# EAGLE design seeed2040 dev board 11-13-22 (EAGLE 9.6.2)
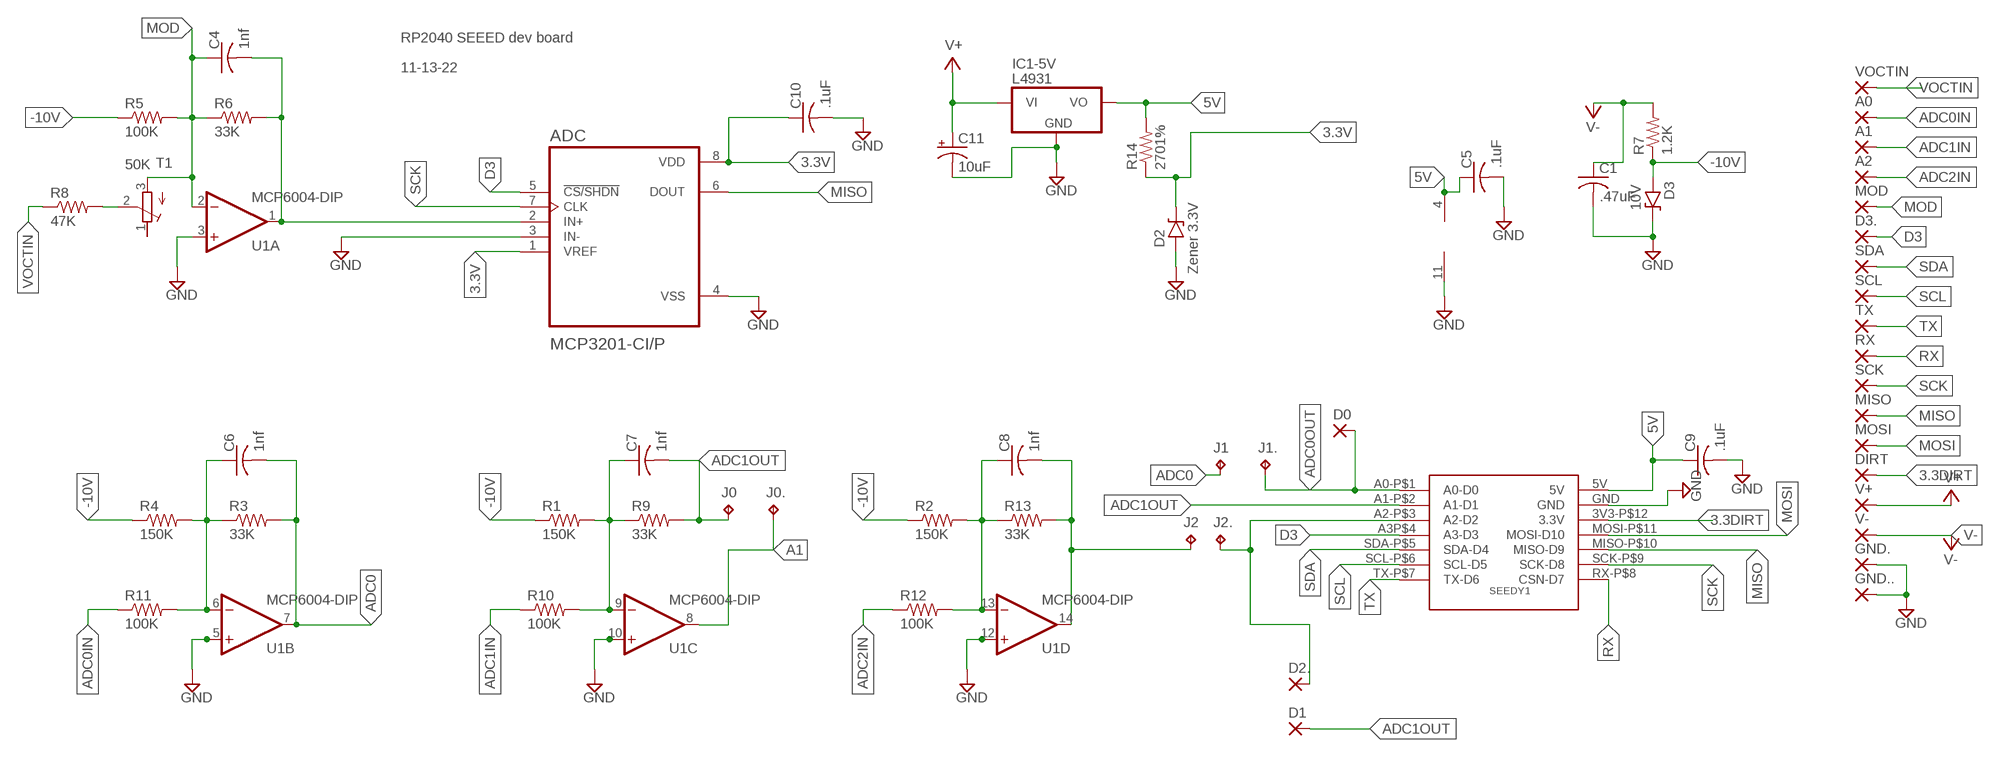
[diagram p0: schematic, sheet 1]

## Parts
A0  WIREPAD1,6/0,9  [1,6/0,9]
A1  WIREPAD1,6/0,9  [1,6/0,9]
A2  WIREPAD1,6/0,9  [1,6/0,9]
ADC  MCP3201-CI/P  [DIP787W46P254L927H533Q8]
C1  .47uF  C-US025-030X050  [C025-030X050]
C4  1nf  C-US025-025X050  [C025-025X050]
C5  .1uF  C-US025-025X050  [C025-025X050]
C6  1nf  C-US025-025X050  [C025-025X050]
C7  1nf  C-US025-025X050  [C025-025X050]
C8  1nf  C-US025-025X050  [C025-025X050]
C9  .1uF  C-US050-025X075  [C050-025X075]
C10  .1uF  C-US025-025X050  [C025-025X050]
C11  10uF  CPOL-USE2.5-7  [E2,5-7]
D0  WIREPAD1,6/0,9  [1,6/0,9]
D1  WIREPAD1,6/0,9  [1,6/0,9]
D2  Zener 3.3V  ZENER.3  [DO41-3]
D2.  WIREPAD1,6/0,9  [1,6/0,9]
D3  10V  ZENER.3  [DO41-3]
D3.  WIREPAD1,6/0,9  [1,6/0,9]
DIRT  WIREPAD1,6/0,9  [1,6/0,9]
GND.  WIREPAD1,6/0,9  [1,6/0,9]
GND..  WIREPAD1,6/0,9  [1,6/0,9]
IC1-5V  L4931  [TO92-]
J0  TPPAD1-13  [P1-13]
J0.  TPPAD1-13  [P1-13]
J1  TPPAD1-13  [P1-13]
J1.  TPPAD1-13  [P1-13]
J2  TPPAD1-13  [P1-13]
J2.  TPPAD1-13  [P1-13]
MISO  WIREPAD1,6/0,9  [1,6/0,9]
MOD  WIREPAD1,6/0,9  [1,6/0,9]
MOSI  WIREPAD1,6/0,9  [1,6/0,9]
R1  150K  R-US_0204/7  [0204/7]
R2  150K  R-US_0204/7  [0204/7]
R3  33K  R-US_0204/7  [0204/7]
R4  150K  R-US_0204/7  [0204/7]
R5  100K  R-US_0204/7  [0204/7]
R6  33K  R-US_0204/7  [0204/7]
R7  1.2K  R-US_0204/7  [0204/7]
R8  47K  R-US_0204/7  [0204/7]
R9  33K  R-US_0204/7  [0204/7]
R10  100K  R-US_0204/7  [0204/7]
R11  100K  R-US_0204/7  [0204/7]
R12  100K  R-US_0204/7  [0204/7]
R13  33K  R-US_0204/7  [0204/7]
R14  2701%  R-US_0204/7  [0204/7]
RX  WIREPAD1,6/0,9  [1,6/0,9]
SCK  WIREPAD1,6/0,9  [1,6/0,9]
SCL  WIREPAD1,6/0,9  [1,6/0,9]
SDA  WIREPAD1,6/0,9  [1,6/0,9]
SEEDY1  SEEED_XIAO_RP2040  [14PIN700MIL]
T1  50K  R-TRIMMT93YA  [RTRIMT93YA]
TX  WIREPAD1,6/0,9  [1,6/0,9]
U1  MCP6004-DIP  [DIL14]
V+  WIREPAD1,6/0,9  [1,6/0,9]
V-  WIREPAD1,6/0,9  [1,6/0,9]
VOCTIN  WIREPAD1,6/0,9  [1,6/0,9]

## Nets
3.3DIRT: DIRT.1(P) SEEDY1.3V3-P$12(3.3V)
3.3V: ADC.1(VREF) ADC.8(VDD) C10.1 D2.C R14.1
5V: C5.1 C9.1 IC1-5V.3(VO) R14.2 SEEDY1.5V U1.4(P:V+)
-10V: D3.A R1.1 R2.1 R4.1 R5.1 R7.1
A1: J0..TP U1.8(C:OUT)
ADC0: C6.2 J1.TP R3.2 U1.7(B:OUT)
ADC0IN: A0.1(P) R11.1
ADC0OUT: D0.1(P) J1..TP SEEDY1.A0-P$1(A0-D0)
ADC1IN: A1.1(P) R10.1
ADC1OUT: C7.2 D1.1(P) J0.TP R9.2 SEEDY1.A1-P$2(A1-D1)
ADC2IN: A2.1(P) R12.1
ADC2OUT: C8.2 J2.TP R13.2 U1.14(D:OUT)
D3: ADC.5(!CS/SHDN) D3..1(P) SEEDY1.A3P$4(A3-D3)
GND: ADC.3(IN-) ADC.4(VSS) C1.2 C5.2 C9.2 C10.2 C11.- D2.A D3.C GND..1(P) GND...1(P) IC1-5V.2(GND) SEEDY1.GND U1.3(A:+IN) U1.5(B:+IN) U1.10(C:+IN) U1.11(P:V-) U1.12(D:+IN)
MISO: ADC.6(DOUT) MISO.1(P) SEEDY1.MISO-P$10(MISO-D9)
MOD: C4.1 MOD.1(P) R5.2 R6.1 T1.3(A) U1.2(A:-IN)
MOSI: MOSI.1(P) SEEDY1.MOSI-P$11(MOSI-D10)
N$1: C6.1 R3.1 R4.2 R11.2 U1.6(B:-IN)
N$3: C7.1 R1.2 R9.1 R10.2 U1.9(C:-IN)
N$4: R8.2 T1.2(S)
N$5: C8.1 R2.2 R12.2 R13.1 U1.13(D:-IN)
N$6: D2..1(P) J2..TP SEEDY1.A2-P$3(A2-D2)
RX: RX.1(P) SEEDY1.RX-P$8(CSN-D7)
SCK: ADC.7(CLK) SCK.1(P) SEEDY1.SCK-P$9(SCK-D8)
SCL: SCL.1(P) SEEDY1.SCL-P$6(SCL-D5)
SDA: SDA.1(P) SEEDY1.SDA-P$5(SDA-D4)
TX: SEEDY1.TX-P$7(TX-D6) TX.1(P)
V+: C11.+ IC1-5V.1(VI) V+.1(P)
V-: C1.1 R7.2 V-.1(P)
VOCTIN: R8.1 VOCTIN.1(P)
VOCTOUT: ADC.2(IN+) C4.2 R6.2 U1.1(A:OUT)
Unconnected: T1.1(E)

## Notes on the sheet
- RP2040 SEEED dev board
- 11-13-22

## Library data of the parts
A0 A1 A2 D0 D1 D2. D3. DIRT GND. GND.. MISO MOD MOSI RX SCK SCL SDA TX V+ V- VOCTIN = wirepad:WIREPAD: Wire PAD connect wire on PCB
ADC = MCP3201-CI_P:MCP3201-CI/P: Check availability <https://pricing.snapeda.com/parts/MCP3201-CI/P/Microchip%20Technology/view-part?ref=eda>; AVAILABILITY: In Stock; DESCRIPTION: 1-Channel Single ADC SAR 100ksps 12-bit Serial Automotive 8-Pin PDIP Tube; MF: Microchip Technology; MP: MCP3201-CI/P; PACKAGE: DIP-8 Microchip; PRICE: None; PURCHASE-URL: https://pricing.snapeda.com/search/part/MCP3201-CI/P/?ref=eda
C1 C4-C8 C10 = rcl:C-US: CAPACITOR, American symbol; SPICEPREFIX: C
C9 = adafruit:C-US: CAPACITOR, American symbol
C11 = rcl:CPOL-US: POLARIZED CAPACITOR, American symbol; SPICEPREFIX: C
D2 D3 = diodes:ZENER
IC1-5V = regulators:L4931
J0 J0. J1 J1. J2 J2. = testpad-CL:TP: Test pad NO NAME
R1-R14 = rcl:R-US_: RESISTOR, American symbol
SEEDY1 = SEEED:SEEED_XIAO_RP2040
T1 = rcl:R-TRIMM: Trimm resistor; SPICEMODEL: X; SPICEPREFIXL: POT
U1 = MusicThingModular-CL:MCP6004-DIP: MCP6004 RAIL TO RAIL QUAD OP AMP

## Board
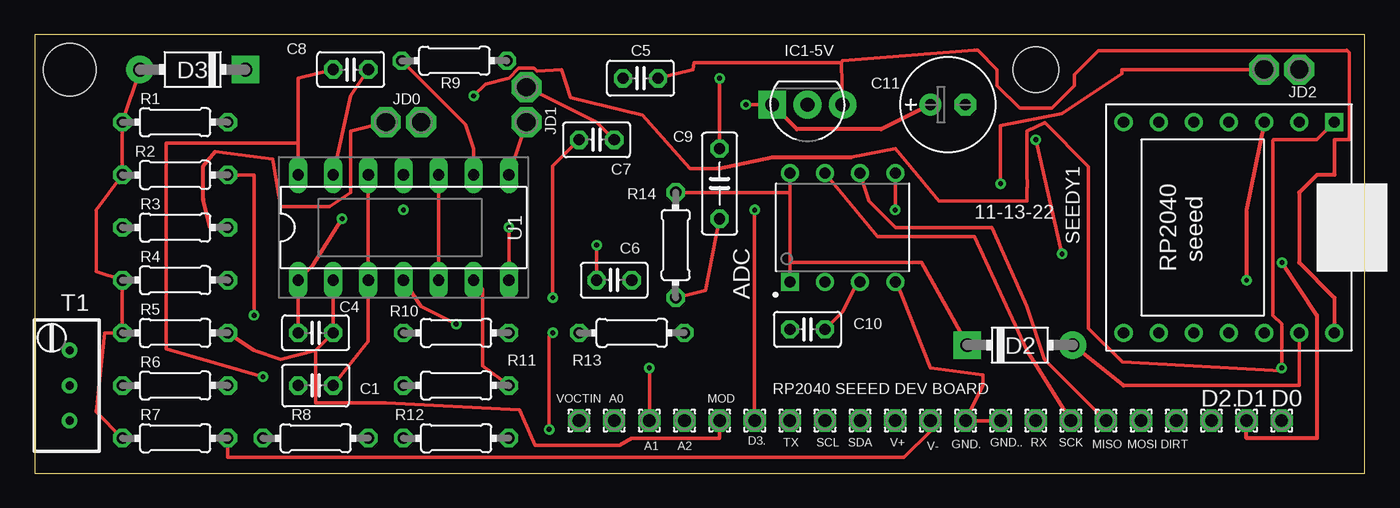
[diagram p1: board, top side]
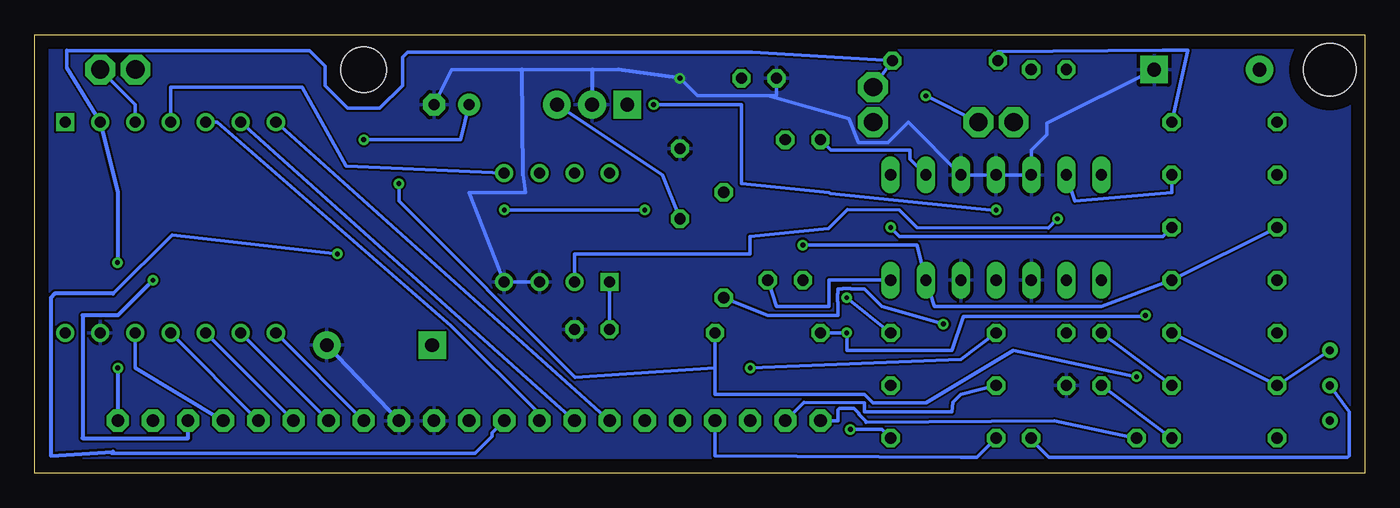
[diagram p2: board, bottom side, seen from below]

Size 96.19 x 31.74 mm. Coordinates in mm from the lower left corner, seen from the top.
Outline: 0,0 96.19,0 96.19,31.74 0,31.74 0,0
Copper layers (1*16): Top 0.035mm / dielectric 1.5mm / Bottom 0.035mm
Design rules "default": minimum track width 6mil, minimum drill 0.35mm, track to track 6mil, track to pad 6mil, pad to pad 6mil, via to via 6mil, smd to smd 6mil, copper to edge 40mil, drill to drill 6mil, minimum pad ring 10mil, minimum via ring 8mil, stop-mask expansion 4mil, vias tented up to drill 0mil, thermal gap 10mil
Holes 3.81 mm at 2.54,29.21
Holes 3.3 mm at 72.39,29.21

### Footprints (pad centres in the part's own frame; a part is rotated, then mirrored left to right if it is on the bottom)
1,6/0,9 = drill 0.914 pad 1.6 octagon: 1 0,0
DIP787W46P254L927H533Q8 = drill 0.8 square: 1 -3.935,3.81 | drill 0.8: 2 -3.935,1.27; 3 -3.935,-1.27; 4 -3.935,-3.81; 5 3.935,-3.81; 6 3.935,-1.27; 7 3.935,1.27; 8 3.935,3.81
C025-030X050 = drill 0.813 octagon: 1 -1.27,0; 2 1.27,0
C025-025X050 = drill 0.813 octagon: 1 -1.27,0; 2 1.27,0
C050-025X075 = drill 0.813 octagon: 1 -2.54,0; 2 2.54,0
E2,5-7 = drill 0.813 pad 1.6: + -1.27,0 | drill 0.813 pad 1.6 octagon: - 1.27,0
DO41-3 = drill 1 pad 2: A 3.81,0 | drill 1 pad 2 square: C -3.81,0
TO92- = drill 1 pad 2 square: 1 -2.54,0 | drill 1 pad 2: 2 0,0; 3 2.54,0
P1-13 = drill 1.321 pad 2.159 octagon: TP 0,0
0204/7 = drill 0.813 octagon: 1 -3.81,0; 2 3.81,0
14PIN700MIL = drill 0.8: 3V3-P$12 2.54,12.7; 5V -2.54,12.7; A1-P$2 0,-2.54; A2-P$3 2.54,-2.54; A3P$4 5.08,-2.54; GND 0,12.7; MISO-P$10 7.62,12.7; MOSI-P$11 5.08,12.7; RX-P$8 12.7,12.7; SCK-P$9 10.16,12.7; SCL-P$6 10.16,-2.54; SDA-P$5 7.62,-2.54; TX-P$7 12.7,-2.54 | drill 0.8 square: A0-P$1 -2.54,-2.54
RTRIMT93YA = drill 0.61: 1 0,-2.54; 2 0,0; 3 0,2.54
DIL14 = drill 0.813 long: 1 -7.62,-3.81; 2 -5.08,-3.81; 3 -2.54,-3.81; 4 0,-3.81; 5 2.54,-3.81; 6 5.08,-3.81; 7 7.62,-3.81; 8 7.62,3.81; 9 5.08,3.81; 10 2.54,3.81; 11 0,3.81; 12 -2.54,3.81; 13 -5.08,3.81; 14 -7.62,3.81

### Placement (x,y rotation side)
A0  41.91,3.81 0 top
A1  44.45,3.81 0 top
A2  46.99,3.81 0 top
ADC  58.42,17.78 90 top
C1  20.32,6.35 0 top
C4  20.32,10.16 180 top
C5  43.81,28.57 180 top
C6  41.91,13.97 0 top
C7  40.64,24.13 0 top
C8  22.86,29.21 180 top
C9  49.53,20.95 90 top
C10  55.88,10.41 0 top
C11  66.04,26.67 0 top
D0  90.17,3.81 0 top
D1  87.63,3.81 0 top
D2  71.25,9.27 0 top
D2.  85.09,3.81 0 top
D3  11.43,29.21 180 top
D3.  52.07,3.81 0 top
DIRT  82.55,3.81 0 top
GND.  67.31,3.81 0 top
GND..  69.85,3.81 0 top
IC1-5V  55.88,26.67 0 top
J0  35.56,27.94 0 top
J0.  35.56,25.4 0 top
J1  25.4,25.4 0 top
J1.  27.94,25.4 0 top
J2  88.9,29.21 0 top
J2.  91.44,29.21 0 top
MISO  77.47,3.81 0 top
MOD  49.53,3.81 0 top
MOSI  80.01,3.81 0 top
R1  10.16,25.4 0 top
R2  10.16,21.59 0 top
R3  10.16,17.78 0 top
R4  10.16,13.97 0 top
R5  10.16,10.16 0 top
R6  10.16,6.35 0 top
R7  10.16,2.54 0 top
R8  20.32,2.54 0 top
R9  30.35,29.84 0 top
R10  30.48,10.16 0 top
R11  30.48,6.35 0 top
R12  30.48,2.54 0 top
R13  43.18,10.16 0 top
R14  46.35,16.51 270 top
RX  72.39,3.81 0 top
SCK  74.93,3.81 0 top
SCL  57.15,3.81 0 top
SDA  59.69,3.81 0 top
SEEDY1  91.44,22.86 180 top
T1  2.54,6.35 0 top
TX  54.61,3.81 0 top
U1  26.67,17.78 0 top
V+  62.23,3.81 0 top
V-  64.77,3.81 0 top
VOCTIN  39.37,3.81 0 top

### Tracks (layer width: path | path; a pad name or v marks a point on that pad's centre or on a via)
3.3DIRT
  Bottom 0.254: DIRT.1 88.9,7.62 SEEDY1.3V3-P$12
3.3V
  Top 0.254: ADC.1 54.61,15.24 | 64.14,15.24 54.61,15.24 | R14.1 54.61,20.32 | 54.61,15.24 54.61,20.32 | 54.61,20.32 ADC.8
  Top 0.305: D2.C 64.14,15.24
  Bottom 0.254: C10.1 ADC.1
5V  (via drill 0.35)
  Top 0.254: 58.34,29.71 58.42,29.84 67.94,30.6 68.2,30.6 69.6,29.2 69.6,28.05 71.23,26.42 73.55,26.42 75.18,28.05 75.18,28.83 76.92,30.57 94.84,30.57 94.87,30.6 95.05,30.42 95.05,24.13 93.98,24.13 | 58.34,29.71 IC1-5V.3 | R14.2 48.49,13.23 C9.1 | v30.48,10.79 27.94,12.06 U1.4 | C5.1 47.62,29.21 47.67,29.71 58.34,29.71
  Top 0.305: SEEDY1.5V 93.98,12.7 91.44,15.24 91.44,20.32 92.71,21.59 93.98,21.59 93.98,24.13
  Bottom 0.254: R14.2 43.18,11.43 38.1,11.43 38.1,12.4 38.12,12.43 38.12,12.97 38.1,12.99 38.1,13.34 37.76,13.34 37.74,13.36 37.19,13.36 37.17,13.34 36.2,13.34 34.92,12.06 v30.48,10.79 | C9.1 50.8,21.59 IC1-5V.3
-10V
  Top 0.254: D3.A R1.1 R2.1 4.45,19.05 4.45,14.61 R4.1 R5.1 5.08,10.16 4.45,4.45 R7.1
A1
  Top 0.254: U1.8 J0..TP
ADC0  (via drill 0.35)
  Top 0.254: U1.7 v34.29,17.78 | 13.04,23.26 17.21,22.74 17.78,19.3 21.34,19.3 22.86,20.32 22.86,24.77 J1.TP | R3.2 12.7,17.78
  Top 0.305: 12.7,17.78 12.19,19.81 12.19,22.23 13.04,23.26
  Bottom 0.254: v34.29,17.78 33.66,17.14 14.61,17.14 R3.2 | C6.2 42.55,12.06 38.73,12.06 38.73,13.97 U1.7
ADC0IN
  Bottom 0.254: R11.1 29.21,5.71 29.78,5.14 29.84,4.45 36.2,4.45 36.2,5.08 40.58,5.14 A0.1
ADC0OUT  (via drill 0.35)
  Top 0.254: SEEDY1.A0-P$1 92.71,24.13 89.57,24.13 89.53,24.07 89.53,11.43 90.17,10.79 v90.17,7.62 90.17,7.4 78.65,8.04 76.2,10.49 76.2,22.2 73.03,25.37 71.75,24.77 71.75,24.43 71.73,24.4 71.73,21.27 71.78,21.23 71.78,20.68 71.75,20.66 71.75,19.68 65.41,19.68 62.23,23.5 59.05,22.86 | 49.41,22.05 47.39,22.05 43.94,25.91 38.73,27.18 38.1,29.21 36.34,29.08 36.12,29.3 35,29.3 34.3,28.6 32.61,28.16 v31.75,27.3
  Top 0.305: 49.41,22.05 53.34,22.86 59.05,22.86
  Bottom 0.254: v31.75,27.3 J1..TP
  Bottom 0.305: v90.17,7.62 D0.1
ADC1IN  (via drill 0.35)
  Top 0.254: A1.1 v44.45,7.62
  Bottom 0.254: v44.45,7.62 29.21,8.26 R10.1
ADC1OUT  (via drill 0.35)
  Top 0.254: C7.2 40.64,25.4 J0.TP
  Top 0.305: v90.19,15.24 92.71,11.43 92.71,2.54 87.63,2.54 D1.1
  Bottom 0.254: J0.TP R9.2 44.32,30.48 69.22,30.48 69.6,30.1 69.6,28.05 71.23,26.42 73.55,26.42 75.18,28.05 75.18,29.46 76.29,30.57 93.83,30.57 93.85,30.6 93.85,29.34 SEEDY1.A1-P$2
  Bottom 0.305: SEEDY1.A1-P$2 90.17,20.32 90.17,15.24 v90.19,15.24
ADC2IN
  Bottom 0.254: R12.1 28.07,1.14 29.21,1.14 46.99,1.27 A2.1
ADC2OUT  (via drill 0.35)
  Top 0.254: U1.14 19.05,23.88 | 19.05,23.88 19.05,28.57 C8.2 | v16.51,6.99 9.53,8.98 9.53,23.88 19.05,23.88 | v69.85,20.95 69.85,25.15 74.3,26.04 78.6,28.9 78.62,29.21 J2.TP
  Bottom 0.254: R13.2 46.99,7.62 | 46.99,7.62 46.99,5.71 36.2,5.71 35.56,5.08 31.75,5.08 25.4,8.89 v16.51,6.99 | 46.99,7.62 57.11,6.95 69.85,19.68 v69.85,20.95
D3  (via drill 0.35)
  Top 0.254: D3..1 v52.07,19.05 | v62.23,19.05 ADC.5
  Bottom 0.254: v52.07,19.05 v62.23,19.05 | ADC.5 73.66,22.23 76.83,27.94 86.36,27.94 SEEDY1.A3P$4
GND  (via drill 0.35)
  Top 0.254: C1.2 24.13,9.53 U1.3 U1.12 | U1.5 U1.10 | v49.53,28.57 C9.2 | ADC.3 59.36,13.51 58.42,11.68 C10.2 | ADC.4 62.27,13.95 64.77,7.62 68.58,7.11 68.58,6.35 GND..1 GND...1 | SEEDY1.GND 91.44,6.35 78.74,6.35
  Top 0.305: 78.74,6.35 D2.A
  Bottom 0.254: D3.C 22.99,25.34 22.99,24.51 24.13,23.37 U1.12 U1.11 U1.10 33.01,25.39 34.49,23.91 36.62,23.91 37.29,25.66 43.18,27.3 | C11.- 66.04,29.21 60.96,29.21 55.88,29.21 53.98,29.21 | ADC.3 ADC.4 64.77,20.32 60.69,20.32 60.87,21.6 | v49.53,28.57 48.26,27.3 43.18,27.3 | 43.18,27.3 42.55,27.3 C5.2
  Bottom 0.305: 55.88,29.21 IC1-5V.2 | v49.53,28.57 53.98,29.21 | 60.87,21.6 60.96,29.21 | D2.A GND...1
  pour Bottom (isolate 0): 0,31.75 0,0 96.52,0 96.52,31.75
MISO
  Top 0.254: ADC.6 60.33,19.68 62.23,17.78 69.22,17.78 71.75,12.06 73.03,8.26 MISO.1
  Bottom 0.254: SEEDY1.MISO-P$10 MISO.1
MOD
  Top 0.254: U1.2 C4.1 20.32,8.89 | R5.2 15.88,8.89 17.78,8.26 20.32,8.89 | MOD.1 49.53,2.54 43.18,2.54 42.29,2.03 36.2,2.03 35.05,4.57 25.4,5.08 20.32,5.08 20.32,8.89
  Bottom 0.254: R5.2 R6.1 T1.3
MOSI
  Bottom 0.254: SEEDY1.MOSI-P$11 MOSI.1
N$1  (via drill 0.35)
  Top 0.254: R11.2 32.38,7.78 32.38,13.34 U1.6 | v40.64,16.51 C6.1
  Bottom 0.254: R3.1 R4.2 19.05,12.06 31.11,12.06 U1.6 32.38,16.51 v40.64,16.51
N$3  (via drill 0.35)
  Top 0.254: v37.47,12.7 37.47,22.23 C7.1 | U1.9 31.75,23.5 31.18,25.21 R9.1
  Bottom 0.254: R1.2 12.81,30.6 14.61,30.6 26.54,30.5 R9.1 | R10.2 v37.47,12.7 | C7.1 38.61,23.37 32.89,23.37 32.89,22.73 U1.9
N$4
  Bottom 0.254: R8.2 24.13,2.41 22.86,1.14 1.27,1.14 1.14,1.27 1.14,4.45 T1.2
N$5  (via drill 0.35)
  Top 0.254: v37.47,10.16 37.21,9.91 v37.21,3.17 | U1.13 22.86,27.3 C8.1 | v15.88,11.43 15.88,21.59 R2.2
  Bottom 0.254: U1.13 20.95,19.68 13.97,20.32 R2.2 | v37.21,3.17 34.92,3.17 R12.2 | R13.1 v37.47,10.16 37.47,8.89 29.84,8.89 29.02,11.35 15.95,11.35 v15.88,11.43
N$6  (via drill 0.35)
  Top 0.305: SEEDY1.A2-P$3 87.63,19.05 v87.63,13.97
  Bottom 0.254: J2..TP 88.9,26.67 SEEDY1.A2-P$3
  Bottom 0.305: v87.63,13.97 90.17,11.43 92.71,11.43 92.71,2.54 85.09,2.54 D2..1
RX
  Bottom 0.254: SEEDY1.RX-P$8 RX.1
SCK
  Top 0.254: SCK.1 71.75,8.89 67.94,17.14 60.96,17.14 ADC.7
  Bottom 0.254: SEEDY1.SCK-P$9 SCK.1
SCL
  Bottom 0.254: SEEDY1.SCL-P$6 SCL.1
SDA
  Bottom 0.254: SEEDY1.SDA-P$5 83,25.4 66.06,10.67 59.69,4.3 SDA.1
TX
  Bottom 0.254: SEEDY1.TX-P$7 TX.1
V+  (via drill 0.35)
  Top 0.254: v74.3,15.88 v72.39,24.13 | IC1-5V.1 v51.44,26.67
  Top 0.305: C11.+ 61.21,24.89 55.12,24.89 IC1-5V.1
  Bottom 0.254: v26.67,19.05 26.73,18.99 38.66,20.25 38.73,20.32 45.09,20.95 45.09,26.67 v51.44,26.67 | v72.39,24.13 65.41,24.13 C11.+ | V+.1 63.12,2.92 63.12,2.67 64.32,1.46 90.61,1.46 90.51,1.57 | 90.51,13 86.25,17.25 v74.3,15.88
  Bottom 0.305: 90.51,13 94.72,13 95.02,12.7 95.02,1.27 90.51,1.57
V-
  Top 0.254: V-.1 64.77,3.05 62.87,1.14 13.97,1.14 R7.2
  Bottom 0.254: R7.2 C1.1
VOCTIN
  Bottom 0.254: R8.1 22.44,3.81 36.07,3.68 36.07,3.74 36.6,4.28 36.6,4.33 36.96,4.68 37.99,4.68 38.1,4.57 38.1,3.81 VOCTIN.1
VOCTOUT  (via drill 0.35)
  Top 0.254: C4.2 U1.1 20.11,15.03 v22.23,18.41
  Bottom 0.254: R6.2 C4.2 | ADC.2 57.15,15.88 44.45,15.88 44.45,17.14 38.81,17.71 37.43,19.08 33.66,19.05 32.38,17.78 22.88,17.76 v22.23,18.41

### Text on the board
tNames: JD0 | JD2 | JD1 | 11-13-22 | RP2040 SEEED DEV BOARD